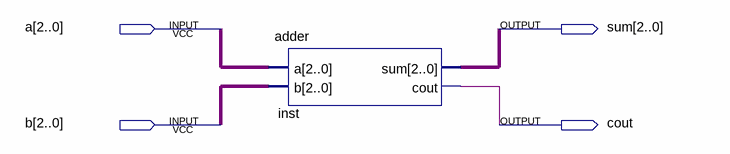
[diagram p0: schematic sheet]
// Quartus schematic 3b_adder.bdf as structural Verilog: 1 symbols, 4 pins
module \3b_adder  (
  input  [2:0] a,
  input  [2:0] b,
  output [2:0] sum,
  output cout
);

  adder inst (.a(a), .b(b), .sum(sum), .cout(cout));
endmodule
